# Altium schematic sheet power.SchDoc
size A3
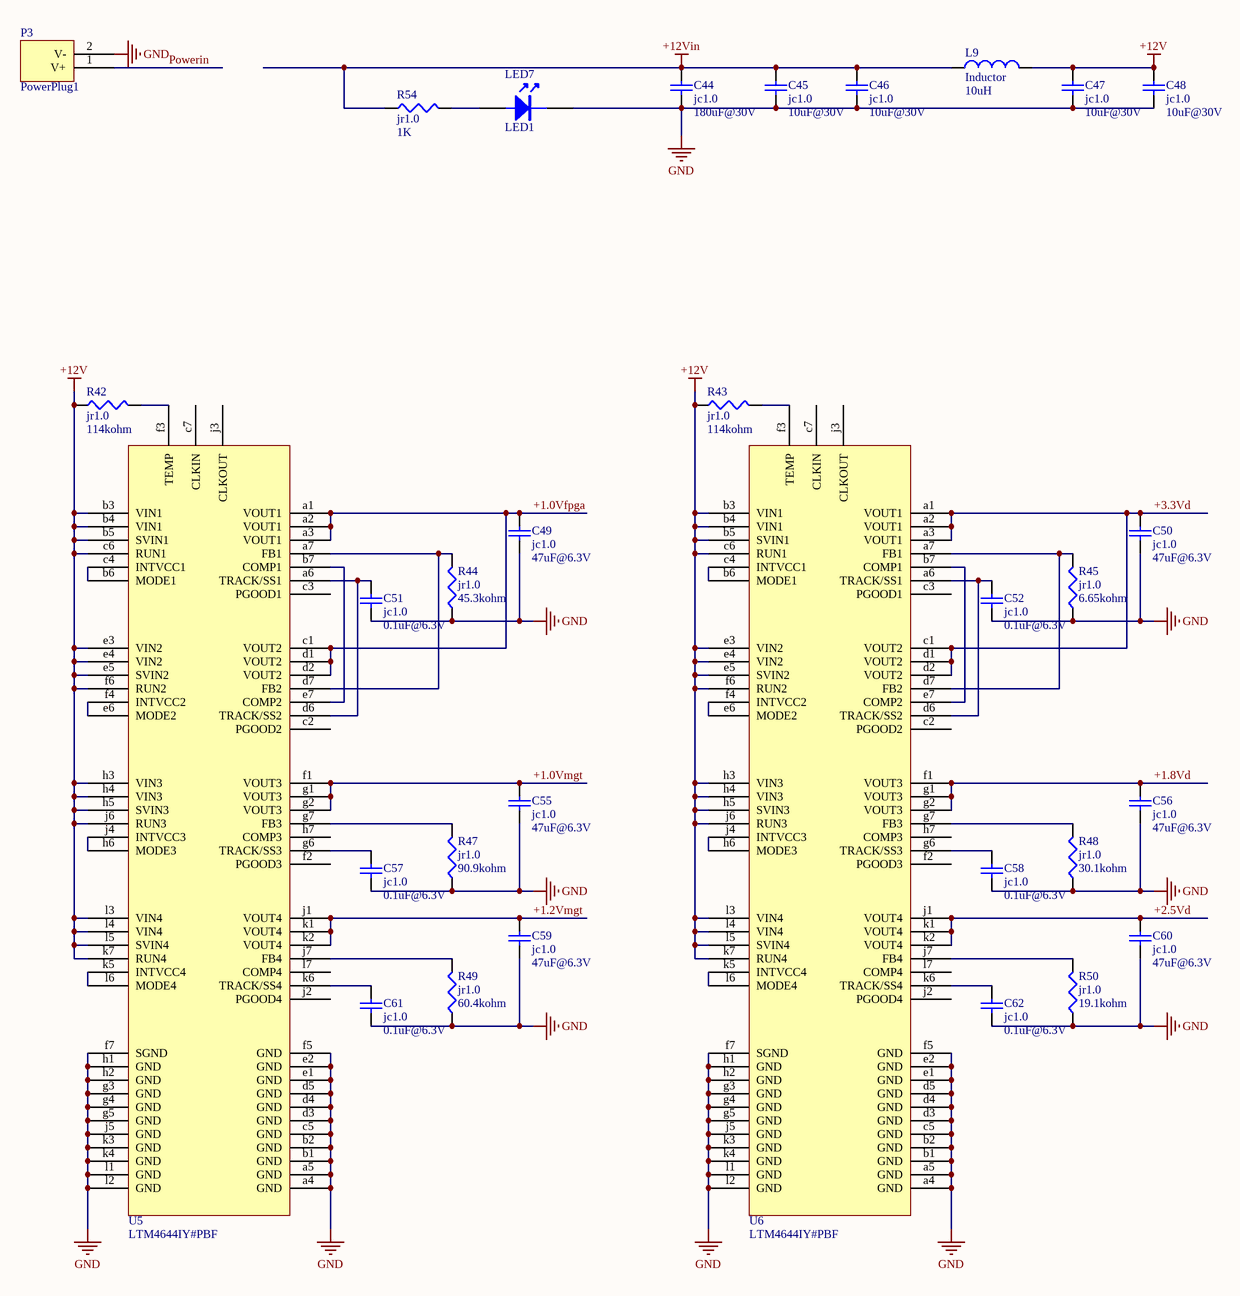
[diagram p0: power.SchDoc]

## Parts
C44  jc1.0  value 180uF@30V  [2220]
C45  jc1.0  value 10uF@30V  [2220]
C46  jc1.0  value 10uF@30V  [2220]
C47  jc1.0  value 10uF@30V  [2220]
C48  jc1.0  value 10uF@30V  [2220]
C49  jc1.0  value 47uF@6.3V  [0805]
C50  jc1.0  value 47uF@6.3V  [0805]
C51  jc1.0  value 0.1uF@6.3V  [0402]
C52  jc1.0  value 0.1uF@6.3V  [0402]
C55  jc1.0  value 47uF@6.3V  [0805]
C56  jc1.0  value 47uF@6.3V  [0805]
C57  jc1.0  value 0.1uF@6.3V  [0402]
C58  jc1.0  value 0.1uF@6.3V  [0402]
C59  jc1.0  value 47uF@6.3V  [0805]
C60  jc1.0  value 47uF@6.3V  [0805]
C61  jc1.0  value 0.1uF@6.3V  [0402]
C62  jc1.0  value 0.1uF@6.3V  [0402]
L9  Inductor  value 10uH  [AXIAL0.3 - 35]
LED7  LED1  [LED1]
P3  PowerPlug1  [POWERPLUG1]
R42  jr1.0  value 114kohm  [0402]
R43  jr1.0  value 114kohm  [0402]
R44  jr1.0  value 45.3kohm  [0805]
R45  jr1.0  value 6.65kohm  [0805]
R47  jr1.0  value 90.9kohm  [0805]
R48  jr1.0  value 30.1kohm  [0805]
R49  jr1.0  value 60.4kohm  [0805]
R50  jr1.0  value 19.1kohm  [0805]
R54  jr1.0  value 1K  [0805]
U5  LTM4644IY#PBF  [BGA77C127P7X11_900X1500X521]
U6  LTM4644IY#PBF  [BGA77C127P7X11_900X1500X521]

## Nets
+12V: C47.2 C48.2 L9.2 R42.1 R43.1 U5.b3(VIN1) U5.b4(VIN1) U5.b5(SVIN1) U5.c6(RUN1) U5.e3(VIN2) U5.e4(VIN2) U5.e5(SVIN2) U5.f6(RUN2) U5.h3(VIN3) U5.h4(VIN3) U5.h5(SVIN3) U5.j6(RUN3) U5.k7(RUN4) U5.l3(VIN4) U5.l4(VIN4) U5.l5(SVIN4) U6.b3(VIN1) U6.b4(VIN1) U6.b5(SVIN1) U6.c6(RUN1) U6.e3(VIN2) U6.e4(VIN2) U6.e5(SVIN2) U6.f6(RUN2) U6.h3(VIN3) U6.h4(VIN3) U6.h5(SVIN3) U6.j6(RUN3) U6.k7(RUN4) U6.l3(VIN4) U6.l4(VIN4) U6.l5(SVIN4)
+12Vin: C44.2 C45.2 C46.2 L9.1 R54.1
GND: C44.1 C45.1 C46.1 C47.1 C48.1 C49.1 C50.1 C51.1 C52.1 C55.1 C56.1 C57.1 C58.1 C59.1 C60.1 C61.1 C62.1 LED7.2 P3.2(V-) R44.1 R45.1 R47.1 R48.1 R49.1 R50.1 U5.a4(GND) U5.a5(GND) U5.b1(GND) U5.b2(GND) U5.c5(GND) U5.d3(GND) U5.d4(GND) U5.d5(GND) U5.e1(GND) U5.e2(GND) U5.f5(GND) U5.f7(SGND) U5.g3(GND) U5.g4(GND) U5.g5(GND) U5.h1(GND) U5.h2(GND) U5.j5(GND) U5.k3(GND) U5.k4(GND) U5.l1(GND) U5.l2(GND) U6.a4(GND) U6.a5(GND) U6.b1(GND) U6.b2(GND) U6.c5(GND) U6.d3(GND) U6.d4(GND) U6.d5(GND) U6.e1(GND) U6.e2(GND) U6.f5(GND) U6.f7(SGND) U6.g3(GND) U6.g4(GND) U6.g5(GND) U6.h1(GND) U6.h2(GND) U6.j5(GND) U6.k3(GND) U6.k4(GND) U6.l1(GND) U6.l2(GND)
+1.0Vfpga: C49.2 U5.a1(VOUT1) U5.a2(VOUT1) U5.a3(VOUT1) U5.c1(VOUT2) U5.d1(VOUT2) U5.d2(VOUT2)
+1.0Vmgt: C55.2 U5.f1(VOUT3) U5.g1(VOUT3) U5.g2(VOUT3)
+1.2Vmgt: C59.2 U5.j1(VOUT4) U5.k1(VOUT4) U5.k2(VOUT4)
+1.8Vd: C56.2 U6.f1(VOUT3) U6.g1(VOUT3) U6.g2(VOUT3)
+2.5Vd: C60.2 U6.j1(VOUT4) U6.k1(VOUT4) U6.k2(VOUT4)
+3.3Vd: C50.2 U6.a1(VOUT1) U6.a2(VOUT1) U6.a3(VOUT1) U6.c1(VOUT2) U6.d1(VOUT2) U6.d2(VOUT2)
Powerin: P3.1(V+)
NetC51_2: C51.2 U5.a6(TRACK/SS1) U5.d6(TRACK/SS2)
NetC52_2: C52.2 U6.a6(TRACK/SS1) U6.d6(TRACK/SS2)
NetC57_2: C57.2 U5.g6(TRACK/SS3)
NetC58_2: C58.2 U6.g6(TRACK/SS3)
NetC61_2: C61.2 U5.k6(TRACK/SS4)
NetC62_2: C62.2 U6.k6(TRACK/SS4)
NetLED7_1: LED7.1 R54.2
NetR42_2: R42.2 U5.f3(TEMP)
NetR43_2: R43.2 U6.f3(TEMP)
NetR44_2: R44.2 U5.a7(FB1) U5.d7(FB2)
NetR45_2: R45.2 U6.a7(FB1) U6.d7(FB2)
NetR47_2: R47.2 U5.g7(FB3)
NetR48_2: R48.2 U6.g7(FB3)
NetR49_2: R49.2 U5.j7(FB4)
NetR50_2: R50.2 U6.j7(FB4)
NetU5_b6: U5.b6(MODE1) U5.c4(INTVCC1)
NetU5_b7: U5.b7(COMP1) U5.e7(COMP2)
NetU5_e6: U5.e6(MODE2) U5.f4(INTVCC2)
NetU5_h6: U5.h6(MODE3) U5.j4(INTVCC3)
NetU5_k5: U5.k5(INTVCC4) U5.l6(MODE4)
NetU6_b6: U6.b6(MODE1) U6.c4(INTVCC1)
NetU6_b7: U6.b7(COMP1) U6.e7(COMP2)
NetU6_e6: U6.e6(MODE2) U6.f4(INTVCC2)
NetU6_h6: U6.h6(MODE3) U6.j4(INTVCC3)
NetU6_k5: U6.k5(INTVCC4) U6.l6(MODE4)

Not connected (* = marked no-connect by the designer): U5 c2(PGOOD2) c3(PGOOD1) c7(CLKIN) f2(PGOOD3) h7(COMP3) j2(PGOOD4) j3(CLKOUT) l7(COMP4); U6 c2(PGOOD2) c3(PGOOD1) c7(CLKIN) f2(PGOOD3) h7(COMP3) j2(PGOOD4) j3(CLKOUT) l7(COMP4)

## Library data of the parts
C44-C52 C55-C62 = Cap: Capacitor; Published: 8-Jun-2000; LatestRevisionDate: 17-Jul-2002; LatestRevisionNote: Re-released for DXP Platform.; PackageReference: RAD-0.3; Publisher: Altium Limited
L9 = Inductor: Code_IEC: 1005; Published: 8-Jun-2000; LatestRevisionDate: 17-Jul-2002; LatestRevisionNote: Re-released for DXP Platform.; PackageReference: 0402-A; Publisher: Altium Limited; Code_JEITA: 0402
R42-R45 R47-R50 R54 = Res: Resistor; Published: 8-Jun-2000; LatestRevisionDate: 04-Mar-2005; LatestRevisionNote: PCB Footprint replaced.; PackageReference: J1-0603; Publisher: Altium Limited